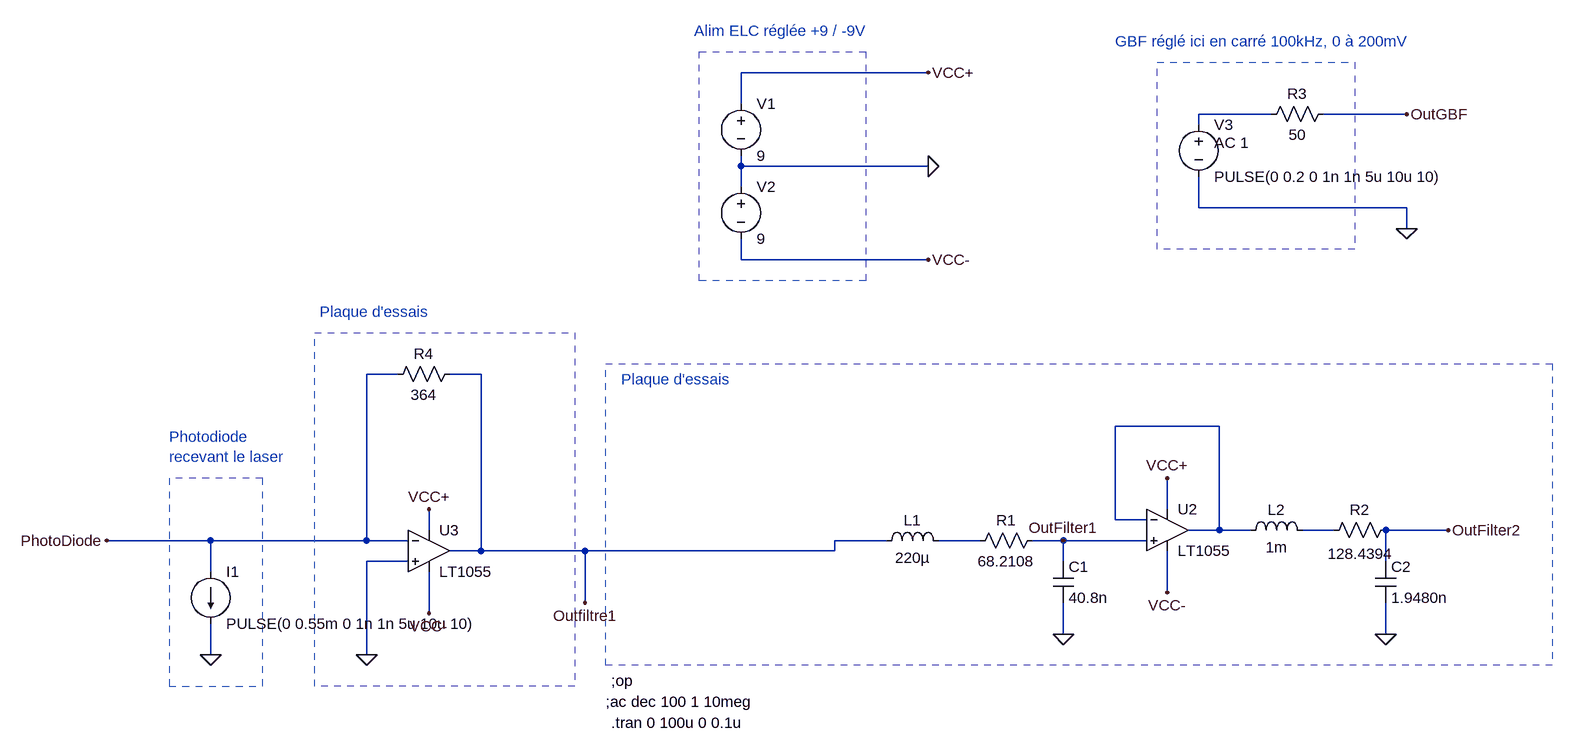
[diagram p0: schematic Draft4.asc]
Draft4.asc, the LTspice schematic file:
Version 4
SHEET 1 1364 1192
WIRE 400 176 112 176
WIRE 112 224 112 176
WIRE 928 240 816 240
WIRE 1136 240 1008 240
WIRE 816 256 816 240
WIRE 112 320 112 304
WIRE 400 320 112 320
WIRE 112 352 112 320
WIRE 816 384 816 336
WIRE 1136 384 816 384
WIRE 1136 416 1136 384
WIRE 112 464 112 432
WIRE 400 464 112 464
WIRE -416 640 -464 640
WIRE -288 640 -336 640
WIRE 848 720 688 720
WIRE 768 848 768 800
WIRE 688 864 688 720
WIRE 736 864 688 864
WIRE -368 880 -368 848
WIRE 848 880 848 720
WIRE 848 880 800 880
WIRE 896 880 848 880
WIRE 1024 880 976 880
WIRE 1200 880 1104 880
WIRE -704 896 -864 896
WIRE -464 896 -464 640
WIRE -464 896 -704 896
WIRE -400 896 -464 896
WIRE 336 896 256 896
WIRE 480 896 416 896
WIRE 608 896 560 896
WIRE 736 896 608 896
WIRE -288 912 -288 640
WIRE -288 912 -336 912
WIRE -128 912 -288 912
WIRE 256 912 256 896
WIRE 256 912 -128 912
WIRE -400 928 -464 928
WIRE 608 928 608 896
WIRE 1104 928 1104 880
WIRE -704 944 -704 896
WIRE 768 976 768 912
WIRE -128 992 -128 912
WIRE -368 1008 -368 944
WIRE 608 1040 608 992
WIRE 1104 1040 1104 992
WIRE -704 1072 -704 1024
WIRE -464 1072 -464 928
FLAG 608 1040 0
FLAG 1104 1040 0
FLAG 608 896 OutFilter1
FLAG 768 800 VCC+
FLAG 768 976 VCC-
FLAG 1200 880 OutFilter2
FLAG 400 320 0
FLAG 1136 416 0
FLAG 400 176 VCC+
FLAG 400 464 VCC-
FLAG 1136 240 OutGBF
FLAG -368 848 VCC+
FLAG -368 1008 VCC-
FLAG -464 1072 0
FLAG -704 1072 0
FLAG -128 992 Outfiltre1
FLAG -864 896 PhotoDiode
SYMBOL res 576 880 R90
WINDOW 0 0 56 VBottom 2
WINDOW 3 32 56 VTop 2
SYMATTR InstName R1
SYMATTR Value 68.2108
SYMBOL ind 320 912 R270
WINDOW 0 32 56 VTop 2
WINDOW 3 5 56 VBottom 2
SYMATTR InstName L1
SYMATTR Value 220µ
SYMBOL cap 592 928 R0
SYMATTR InstName C1
SYMATTR Value 40.8n
SYMBOL OpAmps\\LT1055 768 816 R0
SYMATTR InstName U2
SYMBOL res 1120 864 R90
WINDOW 0 0 56 VBottom 2
WINDOW 3 37 55 VTop 2
SYMATTR InstName R2
SYMATTR Value 128.4394
SYMBOL cap 1088 928 R0
SYMATTR InstName C2
SYMATTR Value 1.9480n
SYMBOL ind 880 896 R270
WINDOW 0 32 56 VTop 2
WINDOW 3 5 56 VBottom 2
SYMATTR InstName L2
SYMATTR Value 1m
SYMBOL voltage 112 208 R0
WINDOW 123 0 0 Left 2
WINDOW 39 0 0 Left 2
SYMATTR InstName V1
SYMATTR Value 9
SYMBOL voltage 112 336 R0
WINDOW 123 0 0 Left 2
WINDOW 39 0 0 Left 2
SYMATTR InstName V2
SYMATTR Value 9
SYMBOL voltage 816 240 R0
WINDOW 123 24 44 Left 2
WINDOW 39 0 0 Left 2
SYMATTR Value2 AC 1
SYMATTR InstName V3
SYMATTR Value PULSE(0 0.2 0 1n 1n 5u 10u 10)
SYMBOL res 1024 224 R90
WINDOW 0 0 56 VBottom 2
WINDOW 3 32 56 VTop 2
SYMATTR InstName R3
SYMATTR Value 50
SYMBOL res -320 624 R90
WINDOW 0 0 56 VBottom 2
WINDOW 3 32 56 VTop 2
SYMATTR InstName R4
SYMATTR Value 364
SYMBOL Opamps\\LT1055 -368 848 R0
SYMATTR InstName U3
SYMBOL current -704 944 R0
WINDOW 123 0 0 Left 2
WINDOW 39 0 0 Left 2
SYMATTR InstName I1
SYMATTR Value PULSE(0 0.55m 0 1n 1n 5u 10u 10)
TEXT -72 648 Left 2 ;Plaque d'essais
TEXT 40 112 Left 2 ;Alim ELC réglée +9 / -9V
TEXT 688 128 Left 2 ;GBF réglé ici en carré 100kHz, 0 à 200mV
TEXT -96 1144 Left 2 !;ac dec 100 1 10meg
TEXT -88 1112 Left 2 !;op
TEXT -88 1176 Left 2 !.tran 0 100u 0 0.1u
TEXT -768 736 Left 2 ;Photodiode \nrecevant le laser
TEXT -536 544 Left 2 ;Plaque d'essais
RECTANGLE Normal 1360 1088 -96 624 2
RECTANGLE Normal 304 496 48 144 2
RECTANGLE Normal 1056 448 752 160 2
RECTANGLE Normal -144 1120 -544 576 2
RECTANGLE Normal -768 1120 -624 800 2

The netlist it stands for:
* Draft4.asc
R1 OutFilter1 N004 68.2108
L1 Outfiltre1 N004 220µ
C1 OutFilter1 0 40.8n
XU2 OutFilter1 N002 VCC+ VCC- N002 LT1055  ; pins In+ In- V+ V- OUT
R2 OutFilter2 N003 128.4394
C2 OutFilter2 0 1.9480n
L2 N002 N003 1m
V1 VCC+ 0 9
V2 0 VCC- 9
V3 N001 0 PULSE(0 0.2 0 1n 1n 5u 10u 10) AC 1
R3 OutGBF N001 50
R4 Outfiltre1 PhotoDiode 364
XU3 0 PhotoDiode VCC+ VCC- Outfiltre1 LT1055  ; pins In+ In- V+ V- OUT
I1 PhotoDiode 0 PULSE(0 0.55m 0 1n 1n 5u 10u 10)
* Plaque d'essais
* Alim ELC réglée +9 / -9V
* GBF réglé ici en carré 100kHz, 0 à 200mV
;ac dec 100 1 10meg
;op
.tran 0 100u 0 0.1u
* Photodiode
* recevant le laser
* Plaque d'essais
.backanno
.end

* Results of the author's LTspice run, read from the files saved beside the schematic
* Operating Point, zero values left out:
*   V(vcc+) = 9 V
*   V(vcc-) = -9 V
*   I(V2) = -5.6 mA
*   I(V1) = -5.6 mA
*   Ix(u2:3) = 2.8 mA
*   Ix(u2:4) = -2.8 mA
*   Ix(u3:3) = 2.8 mA
*   Ix(u3:4) = -2.8 mA
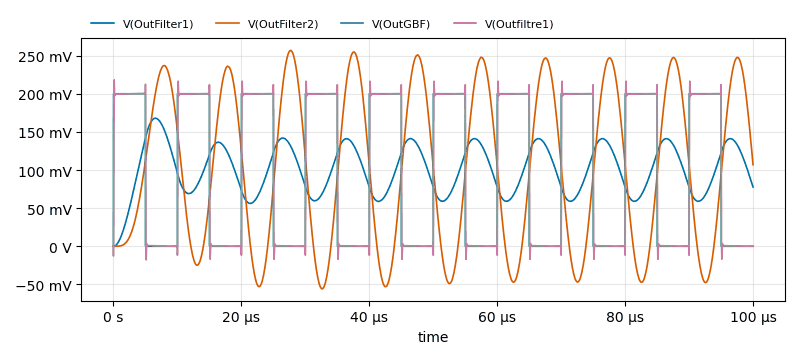
[diagram p1: Transient Analysis of Draft4.asc, plotted from the saved traces]
* Transient Analysis, 1 run:
*   V(OutFilter1): min -153 nV, max 167.9 mV, average 100.3 mV, rms 105.5 mV, last 77.63 mV
*   V(OutFilter2): min -55.81 mV, max 256.9 mV, average 101.8 mV, rms 144.9 mV, last 107 mV
*   V(OutGBF): min 0 V, max 200 mV, average 100 mV, rms 141.4 mV, last 0 V
*   V(Outfiltre1): min -17.94 mV, max 218.3 mV, average 100.1 mV, rms 141.1 mV, last 16.43 µV